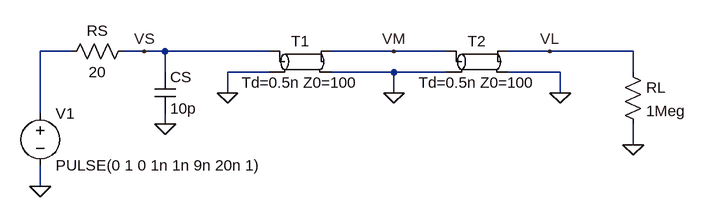
[diagram p0: schematic singleTrace_RCsrc.asc]
singleTrace_RCsrc.asc, the LTspice schematic file:
Version 4
SHEET 1 1128 680
WIRE 176 64 128 64
WIRE 288 64 256 64
WIRE 320 64 288 64
WIRE 480 64 320 64
WIRE 672 64 576 64
WIRE 752 64 672 64
WIRE 912 64 848 64
WIRE 1040 64 912 64
WIRE 320 96 320 64
WIRE 480 96 416 96
WIRE 672 96 576 96
WIRE 752 96 672 96
WIRE 928 96 848 96
WIRE 1040 96 1040 64
WIRE 416 128 416 96
WIRE 672 128 672 96
WIRE 928 128 928 96
WIRE 128 160 128 64
WIRE 320 176 320 160
WIRE 1040 208 1040 176
WIRE 128 272 128 240
FLAG 128 272 0
FLAG 416 128 0
FLAG 672 128 0
FLAG 928 128 0
FLAG 1040 208 0
FLAG 288 64 VS
FLAG 672 64 VM
FLAG 912 64 VL
FLAG 320 176 0
SYMBOL voltage 128 144 R0
WINDOW 123 0 0 Left 0
WINDOW 39 0 0 Left 0
SYMATTR InstName V1
SYMATTR Value PULSE(0 1 0 1n 1n 9n 20n 1)
SYMBOL tline 528 80 R0
SYMATTR InstName T1
SYMATTR Value Td=0.5n Z0=100
SYMBOL tline 800 80 R0
SYMATTR InstName T2
SYMATTR Value Td=0.5n Z0=100
SYMBOL res 1024 80 R0
SYMATTR InstName RL
SYMATTR Value 1Meg
SYMBOL res 272 48 R90
WINDOW 0 0 56 VBottom 2
WINDOW 3 32 56 VTop 2
SYMATTR InstName RS
SYMATTR Value 20
SYMBOL cap 304 96 R0
SYMATTR InstName CS
SYMATTR Value 10p

The netlist it stands for:
* singleTrace_RCsrc.asc
V1 N001 0 PULSE(0 1 0 1n 1n 9n 20n 1)
T1 VS 0 VM 0 Td=0.5n Z0=100
T2 VM 0 VL 0 Td=0.5n Z0=100
RL VL 0 1Meg
RS VS N001 20
CS VS 0 10p
.backanno
.end